# Altium schematic sheet Motor.SchDoc
size A4; SheetNumber: 4; SheetTotal: 12
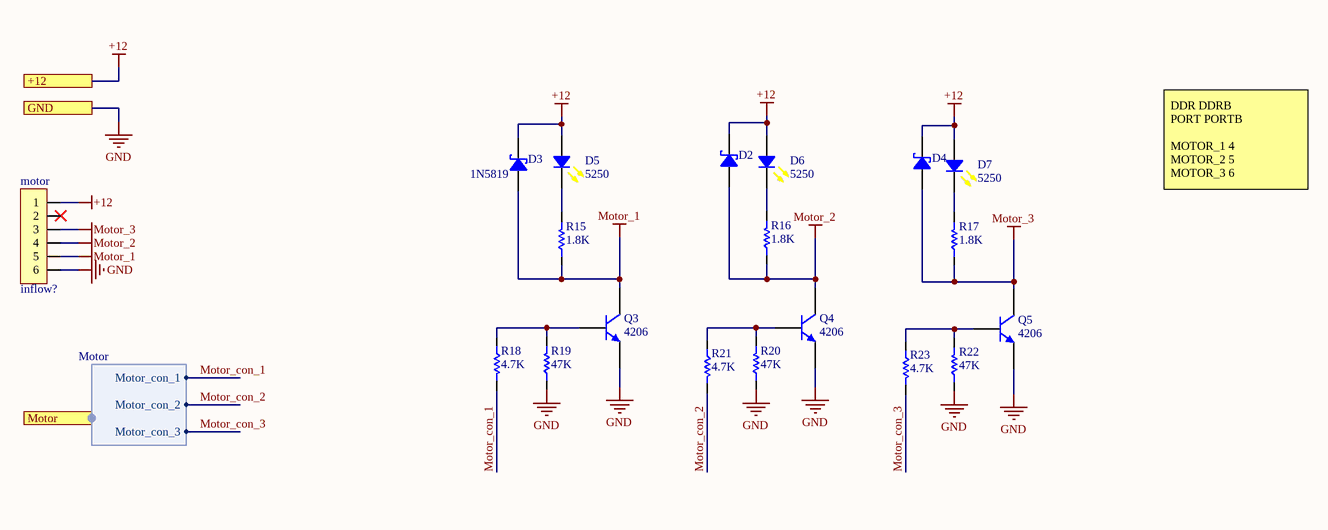
[diagram p0: Motor.SchDoc]

## Parts
D2  1N5819  [430X270D]  (value not drawn)
D3  1N5819  [430X270D]
D4  1N5819  [430X270D]  (value not drawn)
D5  Inflow: 5250  [LED 1206/3216 YELLOW]  (hidden comment: Yellow, 1206)
D6  Inflow: 5250  [LED 1206/3216 YELLOW]  (hidden comment: Yellow, 1206)
D7  Inflow: 5250  [LED 1206/3216 YELLOW]  (hidden comment: Yellow, 1206)
motor  Inflow: inflow?  [MOLEX KK 0022272061]  (hidden comment: 6'Pin)
Q3  Inflow: 4206  [TO-220 AB]  (hidden comment: NPN)
Q4  Inflow: 4206  [TO-220 AB]  (hidden comment: NPN)
Q5  Inflow: 4206  [TO-220 AB]  (hidden comment: NPN)
R15  1.8K  [RES 1206 (3216X08L)]
R16  1.8K  [RES 1206 (3216X08L)]
R17  1.8K  [RES 1206 (3216X08L)]
R18  4.7K  [RES 1206 (3216X08L)]
R19  47K  [RES 1206 (3216X08L)]
R20  47K  [RES 1206 (3216X08L)]
R21  4.7K  [RES 1206 (3216X08L)]
R22  47K  [RES 1206 (3216X08L)]
R23  4.7K  [RES 1206 (3216X08L)]

## Ports
+12, GND, Motor (harness Motor)

## Harnesses
Motor: Motor_con_1, Motor_con_2, Motor_con_3

## Nets
+12: D2.2 D3.2 D4.2 D5.1 D6.1 D7.1 motor.1 ; port +12
GND: motor.6 Q3.3(E) Q4.3(E) Q5.3(E) R19.1 R20.1 R22.1 ; port GND
Motor_1: D3.1 motor.5 Q3.2(C) R15.1
Motor_2: D2.1 motor.4 Q4.2(C) R16.1
Motor_3: D4.1 motor.3 Q5.2(C) R17.1
Motor_con_1: R18.2 ; port Motor.Motor_con_1
Motor_con_2: R21.2 ; port Motor.Motor_con_2
Motor_con_3: R23.2 ; port Motor.Motor_con_3
NetD5_2: D5.2 R15.2
NetD6_2: D6.2 R16.2
NetD7_2: D7.2 R17.2
NetQ3_1: Q3.1(B) R18.1 R19.2
NetQ4_1: Q4.1(B) R20.2 R21.1
NetQ5_1: Q5.1(B) R22.2 R23.1

Not connected (* = marked no-connect by the designer): motor 2*

## Notes on the sheet
- DDR DDRB
  PORT PORTB
  MOTOR_1 4
  MOTOR_2 5
  MOTOR_3 6

## Library data of the parts
D2-D4 = Semi_Diod_Sch_1N5819_SMD: Schottky Rectifiers; Rating: Rating?; Validation: Valid; Inflow: inflow?; Package: SMA; Type: Schottky; Value: 1N5819
D5-D7 = Semi_LED_Yellow_1206: LED; Rating: Rating?; Type: Type?; Validation: Valid; Value: Yellow, 1206; Package: Package?
motor = Con_Signal_6: Signal Connector 6'Pin; Rating: Rating?; Validation: Valid; Value: 6'Pin; Package: Package?; Type: Type?
Q3-Q5 = Semi_BJT_TIP41C: NPN Power transistor; Rating: Rating?; Type: Type?; Validation: NT; Value: NPN; Package: Package?
R15-R23 = Res_SMD_1206: Resistor; Inflow: inflow?; Rating: 0.25W; Validation: Valid; Package: 1206; Type: 10%
  R15-R17: Value: 1.8K
  R18 R21 R23: Value: 4.7K
  R19 R20 R22: Value: 47K